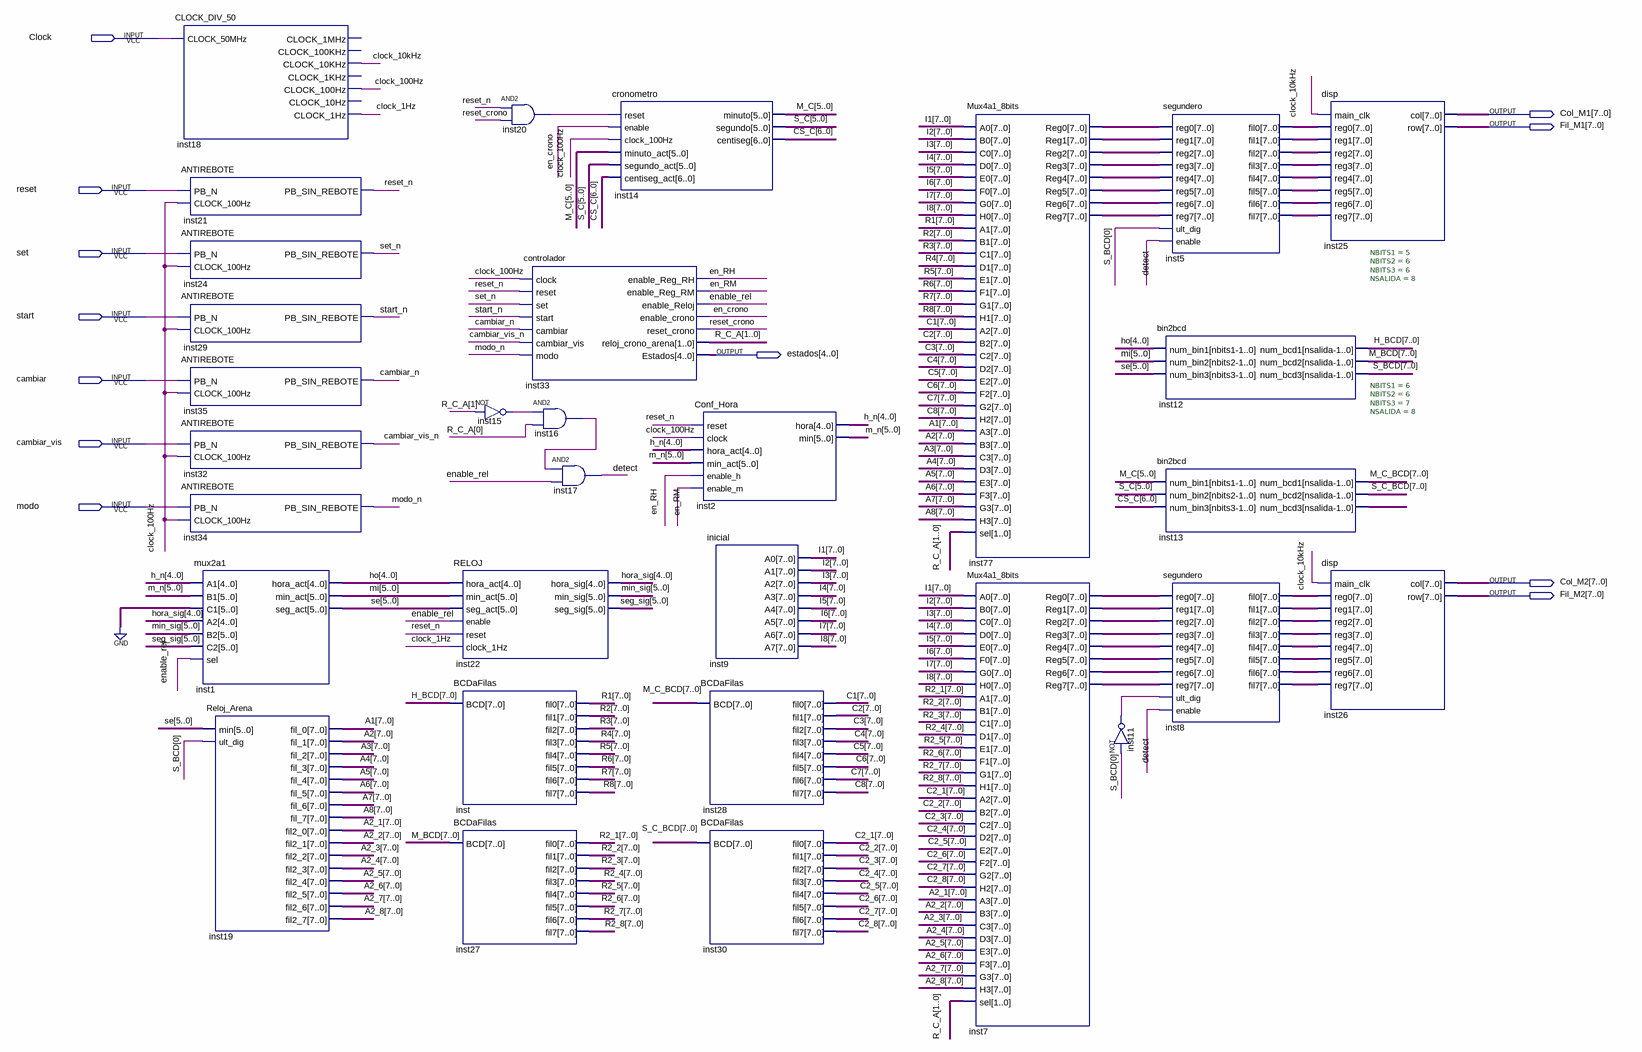
[diagram p0: schematic sheet]
// Quartus schematic Proyecto.bdf as structural Verilog: 31 symbols, 12 pins
module Proyecto (
  input  Clock,
  input  reset,
  input  set,
  input  start,
  input  cambiar,
  input  cambiar_vis,
  input  modo,
  output [7:0] Col_M1,
  output [7:0] Fil_M1,
  output [4:0] estados,
  output [7:0] Col_M2,
  output [7:0] Fil_M2
);

  wire cambiar_n, cambiar_vis_n, clock_1Hz, clock_10kHz, clock_100Hz, detect, en_crono, en_RH, en_RM,
       enable_rel, inst11_out, inst15_out, inst16_out, inst20_out, modo_n, reset_crono, reset_n, set_n,
       start_n;
  wire [1:0] R_C_A;
  wire [4:0] h_n, ho, hora_sig;
  wire [5:0] M_C, m_n, mi, min_sig, S_C, se, seg_sig;
  wire [6:0] CS_C;
  wire [7:0] A1, A2, A2_1, A2_2, A2_3, A2_4, A2_5, A2_6, A2_7, A2_8, A3, A4, A5, A6, A7, A8, C1, C2, C2_1,
       C2_2, C2_3, C2_4, C2_5, C2_6, C2_7, C2_8, C3, C4, C5, C6, C7, C8, H_BCD, I1, I2, I3, I4, I5, I6, I7,
       I8, inst5_fil0, inst5_fil1, inst5_fil2, inst5_fil3, inst5_fil4, inst5_fil5, inst5_fil6, inst5_fil7,
       inst7_reg0, inst7_reg1, inst7_reg2, inst7_reg3, inst7_reg4, inst7_reg5, inst7_reg6, inst7_reg7,
       inst8_fil0, inst8_fil1, inst8_fil2, inst8_fil3, inst8_fil4, inst8_fil5, inst8_fil6, inst8_fil7,
       inst13_num_bcd3, inst77_reg0, inst77_reg1, inst77_reg2, inst77_reg3, inst77_reg4, inst77_reg5,
       inst77_reg6, inst77_reg7, M_BCD, M_C_BCD, R1, R2, R2_1, R2_2, R2_3, R2_4, R2_5, R2_6, R2_7, R2_8, R3,
       R4, R5, R6, R7, R8, S_BCD, S_C_BCD;

  CLOCK_DIV_50 inst18 (
    .CLOCK_50MHz(Clock), .CLOCK_10KHz(clock_10kHz), .CLOCK_100Hz(clock_100Hz), .CLOCK_1Hz(clock_1Hz));  // open: CLOCK_1MHz, CLOCK_100KHz, CLOCK_1KHz, CLOCK_10Hz
  ANTIREBOTE inst21 (.PB_N(reset), .CLOCK_100Hz(clock_100Hz), .PB_SIN_REBOTE(reset_n));
  ANTIREBOTE inst24 (.PB_N(set), .CLOCK_100Hz(clock_100Hz), .PB_SIN_REBOTE(set_n));
  ANTIREBOTE inst29 (.PB_N(start), .CLOCK_100Hz(clock_100Hz), .PB_SIN_REBOTE(start_n));
  ANTIREBOTE inst35 (.PB_N(cambiar), .CLOCK_100Hz(clock_100Hz), .PB_SIN_REBOTE(cambiar_n));
  ANTIREBOTE inst32 (.PB_N(cambiar_vis), .CLOCK_100Hz(clock_100Hz), .PB_SIN_REBOTE(cambiar_vis_n));
  ANTIREBOTE inst34 (.PB_N(modo), .CLOCK_100Hz(clock_100Hz), .PB_SIN_REBOTE(modo_n));
  mux2a1 inst1 (
    .A1(h_n), .B1(m_n), .C1({6{1'b0}}), .A2(hora_sig), .B2(min_sig), .C2(seg_sig), .sel(enable_rel),
    .hora_act(ho), .min_act(mi), .seg_act(se));
  Reloj_Arena inst19 (
    .min(se), .ult_dig(S_BCD[0]), .fil_0(A1), .fil_1(A2), .fil_2(A3), .fil_3(A4), .fil_4(A5), .fil_5(A6),
    .fil_6(A7), .fil_7(A8), .fil2_0(A2_1), .fil2_1(A2_2), .fil2_2(A2_3), .fil2_3(A2_4), .fil2_4(A2_5),
    .fil2_5(A2_6), .fil2_6(A2_7), .fil2_7(A2_8));
  RELOJ inst22 (
    .hora_act(ho), .min_act(mi), .seg_act(se), .enable(enable_rel), .reset(reset_n), .clock_1Hz(clock_1Hz),
    .hora_sig(hora_sig), .min_sig(min_sig), .seg_sig(seg_sig));
  BCDaFilas inst (.BCD(H_BCD), .fil0(R1), .fil1(R2), .fil2(R3), .fil3(R4), .fil4(R5), .fil5(R6), .fil6(R7), .fil7(R8));
  BCDaFilas inst27 (
    .BCD(M_BCD), .fil0(R2_1), .fil1(R2_2), .fil2(R2_3), .fil3(R2_4), .fil4(R2_5), .fil5(R2_6), .fil6(R2_7),
    .fil7(R2_8));
  and inst20 (inst20_out, reset_n, reset_crono);
  not inst15 (inst15_out, R_C_A[1]);
  controlador inst33 (
    .clock(clock_100Hz), .reset(reset_n), .set(set_n), .start(start_n), .cambiar(cambiar_n),
    .cambiar_vis(cambiar_vis_n), .modo(modo_n), .enable_Reg_RH(en_RH), .enable_Reg_RM(en_RM),
    .enable_Reloj(enable_rel), .enable_crono(en_crono), .reset_crono(reset_crono), .reloj_crono_arena(R_C_A),
    .Estados(estados));
  and inst16 (inst16_out, inst15_out, R_C_A[0]);
  and inst17 (detect, inst16_out, enable_rel);
  cronometro inst14 (
    .reset(inst20_out), .enable(en_crono), .clock_100Hz(clock_100Hz), .minuto_act(M_C), .segundo_act(S_C),
    .centiseg_act(CS_C), .minuto(M_C), .segundo(S_C), .centiseg(CS_C));
  Conf_Hora inst2 (
    .reset(reset_n), .clock(clock_100Hz), .hora_act(h_n), .min_act(m_n), .enable_h(en_RH), .enable_m(en_RM),
    .hora(h_n), .min(m_n));
  inicial inst9 (.A0(I1), .A1(I2), .A2(I3), .A3(I4), .A4(I5), .A5(I6), .A6(I7), .A7(I8));
  BCDaFilas inst28 (
    .BCD(M_C_BCD), .fil0(C1), .fil1(C2), .fil2(C3), .fil3(C4), .fil4(C5), .fil5(C6), .fil6(C7), .fil7(C8));
  BCDaFilas inst30 (
    .BCD(S_C_BCD), .fil0(C2_1), .fil1(C2_2), .fil2(C2_3), .fil3(C2_4), .fil4(C2_5), .fil5(C2_6), .fil6(C2_7),
    .fil7(C2_8));
  Mux4a1_8bits inst77 (
    .A0(I1), .B0(I2), .C0(I3), .D0(I4), .E0(I5), .F0(I6), .G0(I7), .H0(I8), .A1(R1), .B1(R2), .C1(R3),
    .D1(R4), .E1(R5), .F1(R6), .G1(R7), .H1(R8), .A2(C1), .B2(C2), .C2(C3), .D2(C4), .E2(C5), .F2(C6),
    .G2(C7), .H2(C8), .A3(A1), .B3(A2), .C3(A3), .D3(A4), .E3(A5), .F3(A6), .G3(A7), .H3(A8), .sel(R_C_A),
    .Reg0(inst77_reg0), .Reg1(inst77_reg1), .Reg2(inst77_reg2), .Reg3(inst77_reg3), .Reg4(inst77_reg4),
    .Reg5(inst77_reg5), .Reg6(inst77_reg6), .Reg7(inst77_reg7));
  Mux4a1_8bits inst7 (
    .A0(I1), .B0(I2), .C0(I3), .D0(I4), .E0(I5), .F0(I6), .G0(I7), .H0(I8), .A1(R2_1), .B1(R2_2), .C1(R2_3),
    .D1(R2_4), .E1(R2_5), .F1(R2_6), .G1(R2_7), .H1(R2_8), .A2(C2_1), .B2(C2_2), .C2(C2_3), .D2(C2_4),
    .E2(C2_5), .F2(C2_6), .G2(C2_7), .H2(C2_8), .A3(A2_1), .B3(A2_2), .C3(A2_3), .D3(A2_4), .E3(A2_5),
    .F3(A2_6), .G3(A2_7), .H3(A2_8), .sel(R_C_A), .Reg0(inst7_reg0), .Reg1(inst7_reg1), .Reg2(inst7_reg2),
    .Reg3(inst7_reg3), .Reg4(inst7_reg4), .Reg5(inst7_reg5), .Reg6(inst7_reg6), .Reg7(inst7_reg7));
  not inst11 (inst11_out, S_BCD[0]);
  segundero inst5 (
    .reg0(inst77_reg0), .reg1(inst77_reg1), .reg2(inst77_reg2), .reg3(inst77_reg3), .reg4(inst77_reg4),
    .reg5(inst77_reg5), .reg6(inst77_reg6), .reg7(inst77_reg7), .ult_dig(S_BCD[0]), .enable(detect),
    .fil0(inst5_fil0), .fil1(inst5_fil1), .fil2(inst5_fil2), .fil3(inst5_fil3), .fil4(inst5_fil4),
    .fil5(inst5_fil5), .fil6(inst5_fil6), .fil7(inst5_fil7));
  bin2bcd #(.NBITS1(5), .NBITS2(6), .NBITS3(6), .NSALIDA(8)) inst12 (
    .num_bin1(ho), .num_bin2(mi), .num_bin3(se), .num_bcd1(H_BCD), .num_bcd2(M_BCD), .num_bcd3(S_BCD));
  bin2bcd #(.NBITS1(6), .NBITS2(6), .NBITS3(7), .NSALIDA(8)) inst13 (
    .num_bin1(M_C), .num_bin2(S_C), .num_bin3(CS_C), .num_bcd1(M_C_BCD), .num_bcd2(S_C_BCD),
    .num_bcd3(inst13_num_bcd3));
  segundero inst8 (
    .reg0(inst7_reg0), .reg1(inst7_reg1), .reg2(inst7_reg2), .reg3(inst7_reg3), .reg4(inst7_reg4),
    .reg5(inst7_reg5), .reg6(inst7_reg6), .reg7(inst7_reg7), .ult_dig(inst11_out), .enable(detect),
    .fil0(inst8_fil0), .fil1(inst8_fil1), .fil2(inst8_fil2), .fil3(inst8_fil3), .fil4(inst8_fil4),
    .fil5(inst8_fil5), .fil6(inst8_fil6), .fil7(inst8_fil7));
  disp inst25 (
    .main_clk(clock_10kHz), .reg0(inst5_fil0), .reg1(inst5_fil1), .reg2(inst5_fil2), .reg3(inst5_fil3),
    .reg4(inst5_fil4), .reg5(inst5_fil5), .reg6(inst5_fil6), .reg7(inst5_fil7), .col(Col_M1), .row(Fil_M1));
  disp inst26 (
    .main_clk(clock_10kHz), .reg0(inst8_fil0), .reg1(inst8_fil1), .reg2(inst8_fil2), .reg3(inst8_fil3),
    .reg4(inst8_fil4), .reg5(inst8_fil5), .reg6(inst8_fil6), .reg7(inst8_fil7), .col(Col_M2), .row(Fil_M2));
endmodule
